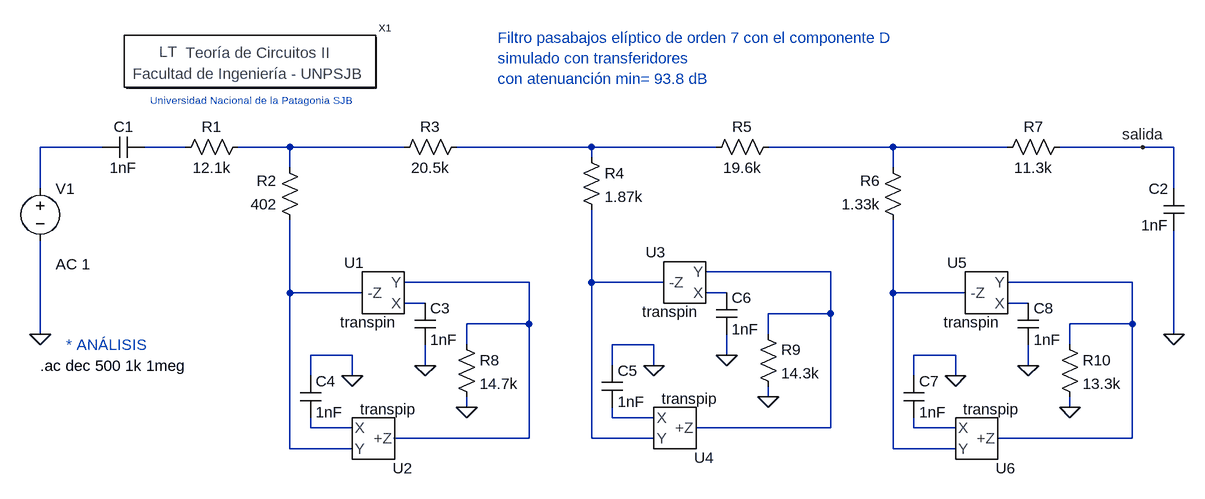
[diagram p0: schematic Filtro eliptico pasabajos de 7 orden con componente D simulado con transferidores.asc]
Filtro eliptico pasabajos de 7 orden con componente D simulado con transferidores.asc, the LTspice schematic file:
Version 4
SHEET 1 880 680
WIRE -944 -352 -1040 -352
WIRE -816 -352 -880 -352
WIRE -656 -352 -736 -352
WIRE -480 -352 -656 -352
WIRE -192 -352 -400 -352
WIRE 0 -352 -192 -352
WIRE 272 -352 80 -352
WIRE 448 -352 272 -352
WIRE 656 -352 528 -352
WIRE 704 -352 656 -352
WIRE -192 -336 -192 -352
WIRE -656 -320 -656 -352
WIRE 272 -320 272 -352
WIRE -1040 -288 -1040 -352
WIRE 704 -288 704 -352
WIRE 176 -160 -16 -160
WIRE -288 -144 -480 -144
WIRE -192 -144 -192 -256
WIRE -80 -144 -192 -144
WIRE 640 -144 448 -144
WIRE -656 -128 -656 -240
WIRE -544 -128 -656 -128
WIRE 16 -128 -16 -128
WIRE 272 -128 272 -240
WIRE 384 -128 272 -128
WIRE -448 -112 -480 -112
WIRE 480 -112 448 -112
WIRE 176 -96 176 -160
WIRE 176 -96 80 -96
WIRE -288 -80 -288 -144
WIRE -288 -80 -384 -80
WIRE 640 -80 640 -144
WIRE 640 -80 544 -80
WIRE -1040 -64 -1040 -208
WIRE 80 -64 80 -96
WIRE 704 -64 704 -224
WIRE -384 -48 -384 -80
WIRE -96 -48 -160 -48
WIRE 544 -48 544 -80
WIRE -560 -32 -624 -32
WIRE 16 -32 16 -64
WIRE 368 -32 304 -32
WIRE -448 -16 -448 -48
WIRE -160 -16 -160 -48
WIRE -96 -16 -96 -48
WIRE 480 -16 480 -48
WIRE -624 0 -624 -32
WIRE -560 0 -560 -32
WIRE 304 0 304 -32
WIRE 368 0 368 -32
WIRE 80 32 80 16
WIRE -384 48 -384 32
WIRE 544 48 544 32
WIRE -160 64 -160 48
WIRE -96 64 -160 64
WIRE -624 80 -624 64
WIRE -560 80 -624 80
WIRE 176 80 176 -96
WIRE 176 80 -32 80
WIRE 304 80 304 64
WIRE 368 80 304 80
WIRE -288 96 -288 -80
WIRE -288 96 -496 96
WIRE -192 96 -192 -144
WIRE -96 96 -192 96
WIRE 640 96 640 -80
WIRE 640 96 432 96
WIRE -656 112 -656 -128
WIRE -560 112 -656 112
WIRE 272 112 272 -128
WIRE 368 112 272 112
FLAG 704 -64 0
FLAG -1040 -64 0
FLAG 656 -352 salida
FLAG -448 -16 0
FLAG -384 48 0
FLAG -560 0 0
FLAG 16 -32 0
FLAG 80 32 0
FLAG -96 -16 0
FLAG 480 -16 0
FLAG 544 48 0
FLAG 368 0 0
SYMBOL voltage -1040 -304 R0
WINDOW 123 24 132 Left 2
WINDOW 39 0 0 Left 2
SYMATTR Value2 AC 1
SYMATTR InstName V1
SYMATTR Value ""
SYMBOL cap -880 -368 R90
WINDOW 0 0 32 VBottom 2
WINDOW 3 32 32 VTop 2
SYMATTR InstName C1
SYMATTR Value 1nF
SYMBOL cap 720 -224 R180
WINDOW 0 24 64 Left 2
WINDOW 3 24 8 Left 2
SYMATTR InstName C2
SYMATTR Value 1nF
SYMBOL res -720 -368 R90
WINDOW 0 0 56 VBottom 2
WINDOW 3 32 56 VTop 2
SYMATTR InstName R1
SYMATTR Value 12.1k
SYMBOL res -640 -224 R180
WINDOW 0 36 76 Left 2
WINDOW 3 36 40 Left 2
SYMATTR InstName R2
SYMATTR Value 402
SYMBOL res -496 -336 R270
WINDOW 0 32 56 VTop 2
WINDOW 3 0 56 VBottom 2
SYMATTR InstName R3
SYMATTR Value 20.5k
SYMBOL res -208 -352 R0
SYMATTR InstName R4
SYMATTR Value 1.87k
SYMBOL res 96 -368 R90
WINDOW 0 0 56 VBottom 2
WINDOW 3 32 56 VTop 2
SYMATTR InstName R5
SYMATTR Value 19.6k
SYMBOL res 288 -224 R180
WINDOW 0 36 76 Left 2
WINDOW 3 36 40 Left 2
SYMATTR InstName R6
SYMATTR Value 1.33k
SYMBOL res 432 -336 R270
WINDOW 0 32 56 VTop 2
WINDOW 3 0 56 VBottom 2
SYMATTR InstName R7
SYMATTR Value 11.3k
SYMBOL transpin -512 -192 M0
SYMATTR InstName U1
SYMBOL transpip -528 160 M180
SYMATTR InstName U2
SYMBOL cap -640 0 R0
SYMATTR InstName C4
SYMATTR Value 1nF
SYMBOL res -400 -64 R0
SYMATTR InstName R8
SYMATTR Value 14.7k
SYMBOL cap -464 -112 R0
SYMATTR InstName C3
SYMATTR Value 1nF
SYMBOL transpin -48 -208 M0
SYMATTR InstName U3
SYMBOL transpip -64 144 M180
SYMATTR InstName U4
SYMBOL cap -176 -16 R0
SYMATTR InstName C5
SYMATTR Value 1nF
SYMBOL res 64 -80 R0
SYMATTR InstName R9
SYMATTR Value 14.3k
SYMBOL cap 0 -128 R0
SYMATTR InstName C6
SYMATTR Value 1nF
SYMBOL transpin 416 -192 M0
SYMATTR InstName U5
SYMBOL transpip 400 160 M180
SYMATTR InstName U6
SYMBOL cap 288 0 R0
SYMATTR InstName C7
SYMATTR Value 1nF
SYMBOL res 528 -64 R0
SYMATTR InstName R10
SYMATTR Value 13.3k
SYMBOL cap 464 -112 R0
SYMATTR InstName C8
SYMATTR Value 1nF
SYMBOL Teoría\ de\ Circuitos\ II -720 -480 R0
SYMATTR InstName X1
TEXT -336 -520 Left 2 ;Filtro pasabajos elíptico de orden 7 con el componente D\nsimulado con transferidores\ncon atenuanción min= 93.8 dB
TEXT -1040 -16 Left 2 !.ac dec 500 1k 1meg
TEXT -720 -424 Center 1 ;Universidad Nacional de la Patagonia SJB
TEXT -1000 -48 Left 2 ;* ANÁLISIS

The netlist it stands for:
* Filtro eliptico pasabajos de 7 orden con componente D simulado con transferidores.asc
V1 N001 0 AC 1
C1 N002 N001 1nF
C2 0 salida 1nF
R1 N003 N002 12.1k
R2 N010 N003 402
R3 N003 N004 20.5k
R4 N004 N008 1.87k
R5 N005 N004 19.6k
R6 N012 N005 1.33k
R7 N005 salida 11.3k
XU1 N007 N013 N010 transpin  ; pins Y X Z
XU2 N010 N016 N007 transpip  ; pins Y X Z
C4 0 N016 1nF
R8 N007 0 14.7k
C3 N013 0 1nF
XU3 N006 N011 N008 transpin  ; pins Y X Z
XU4 N008 N015 N006 transpip  ; pins Y X Z
C5 0 N015 1nF
R9 N006 0 14.3k
C6 N011 0 1nF
XU5 N009 N014 N012 transpin  ; pins Y X Z
XU6 N012 N017 N009 transpip  ; pins Y X Z
C7 0 N017 1nF
R10 N009 0 13.3k
C8 N014 0 1nF
XX1 Teoría de Circuitos II
* Filtro pasabajos elíptico de orden 7 con el componente D
* simulado con transferidores
* con atenuanción min= 93.8 dB
.ac dec 500 1k 1meg
* Universidad Nacional de la Patagonia SJB
* * ANÁLISIS
.lib ..\sym\Circuitos2\ComponentesIdeales\compoideales.lib
.backanno
.end